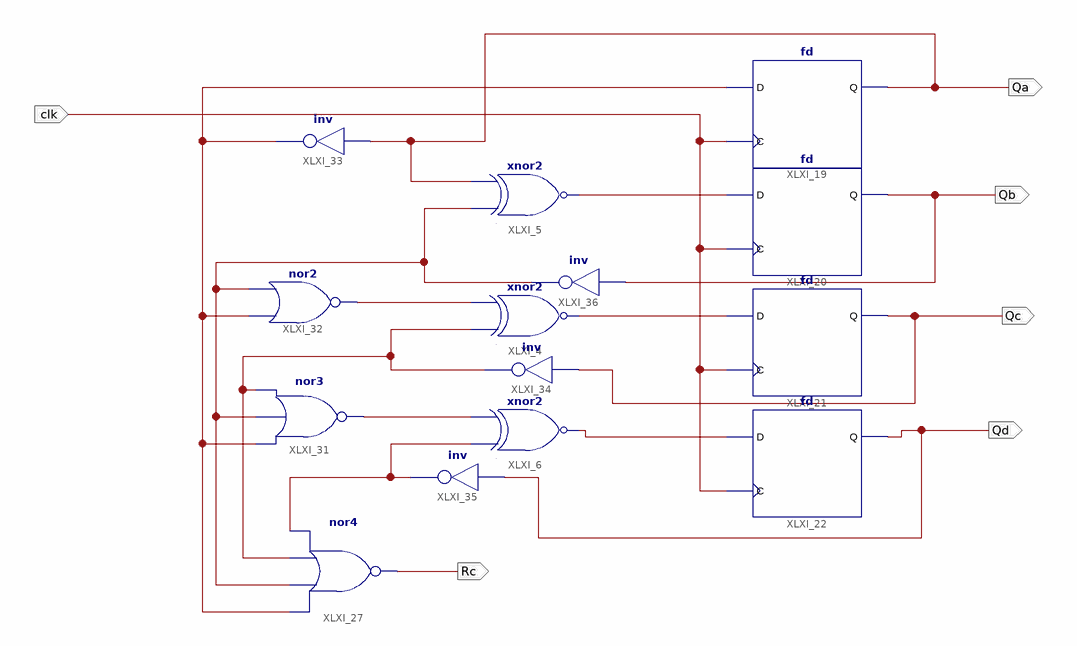
[diagram p0: schematic sheet 1]
// Xilinx ISE schematic Counter_4bit.sch (spartan3) as structural Verilog: 14 symbols, 6 ports
module Counter_4bit (
  input  clk,
  output Qb,
  output Qa,
  output Qd,
  output Qc,
  output Rc
);

  wire XLXN_2, XLXN_4, XLXN_5, XLXN_6, XLXN_9, XLXN_57, XLXN_58, XLXN_85, XLXN_86;

  xnor XLXI_4 (XLXN_4, XLXN_58, XLXN_9);
  xnor XLXI_5 (XLXN_6, XLXN_86, Qa);
  xnor XLXI_6 (XLXN_5, XLXN_57, XLXN_2);
  fd XLXI_19 (.C(clk), .D(XLXN_85), .Q(Qa));
  fd XLXI_20 (.C(clk), .D(XLXN_6), .Q(Qb));
  fd XLXI_22 (.C(clk), .D(XLXN_5), .Q(Qd));
  fd XLXI_21 (.C(clk), .D(XLXN_4), .Q(Qc));
  nor XLXI_27 (Rc, XLXN_85, XLXN_86, XLXN_58, XLXN_57);
  nor XLXI_31 (XLXN_2, XLXN_85, XLXN_86, XLXN_58);
  nor XLXI_32 (XLXN_9, XLXN_85, XLXN_86);
  not XLXI_33 (XLXN_85, Qa);
  not XLXI_34 (XLXN_58, Qc);
  not XLXI_35 (XLXN_57, Qd);
  not XLXI_36 (XLXN_86, Qb);
endmodule
